# Altium schematic sheet MCU2_USB.SchDoc: USB_OTG_FS
size A4; DocumentNumber: MB1246; Revision: B.1; SheetNumber: 9; SheetTotal: 17; Project: STM32H7xxI-EVAL
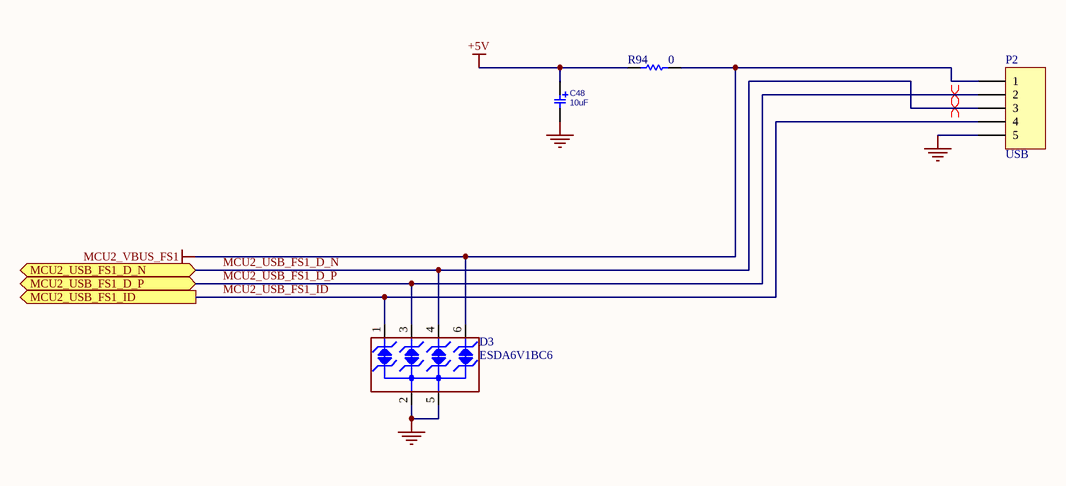
[diagram p0: MCU2_USB.SchDoc]

## Parts
C48  10uF  [C_TN_3216]
D3  ESDA6V1BC6  [SOT95P280X145-6N]
P2  USB  [xh-5]
R94  0  [R0603E]

## Ports
MCU2_USB_FS1_D_N (bidir), MCU2_USB_FS1_D_P (bidir), MCU2_USB_FS1_ID (out)

## Nets
+5V: C48.1 R94.2
GND: C48.2 D3.2(IO2) D3.5(IO4) P2.5
MCU2_VBUS_FS1: D3.6(NC) P2.1 R94.1
MCU2_USB_FS1_D_N: D3.4(IO3) P2.3 ; port MCU2_USB_FS1_D_N
MCU2_USB_FS1_D_P: D3.3(GND) P2.2 ; port MCU2_USB_FS1_D_P
MCU2_USB_FS1_ID: D3.1(IO1) P2.4 ; port MCU2_USB_FS1_ID

## Layout directives
differential pair: MCU2_USB_FS1_D_N, MCU2_USB_FS1_D_P

## Notes on the sheet
- Title:
- Project:
- Size:
- Date:
- A4
- Reference:
- Sheet:
- Revision:
- of

## Library data of the parts
C48 = CAP_SMD_TAN_10uF_6.3V: CAP, SMD, TAN; PARAM: 20%, 300mOhm, -55~105oC; MANF: VISHAY; MANF_P#: T55A106M6R3C0300; PARAM2: 6.3V; PRICE: 0.46$; VALUE: 10uF
D3 = ESDA6V1BC6: 4-line ESD protection; Manuf_1: STM; Manuf_Part_1: ESDA5V3L; Ref St: 9179034; Provided: ST; ECCN_US/EU: EAR99/NEC; Distrib: ST; Order: ESDA5V3L; Ordered by: STM
P2 = Header 5: Header, 5-Pin; LatestRevisionDate: 17-Jul-2002; LatestRevisionNote: Re-released for DXP Platform.; Publisher: Altium Limited
R94 = Res1: Resistor; Value: 1K; Published: 8-Jun-2000; Revision: July-2002: Re-released for DXP Platform.; Publisher: Altium Limited